# Altium schematic sheet TSE_mother_board_MCU.SchDoc
size 594 x 420 mm; SheetNumber: 2; SheetTotal: 3
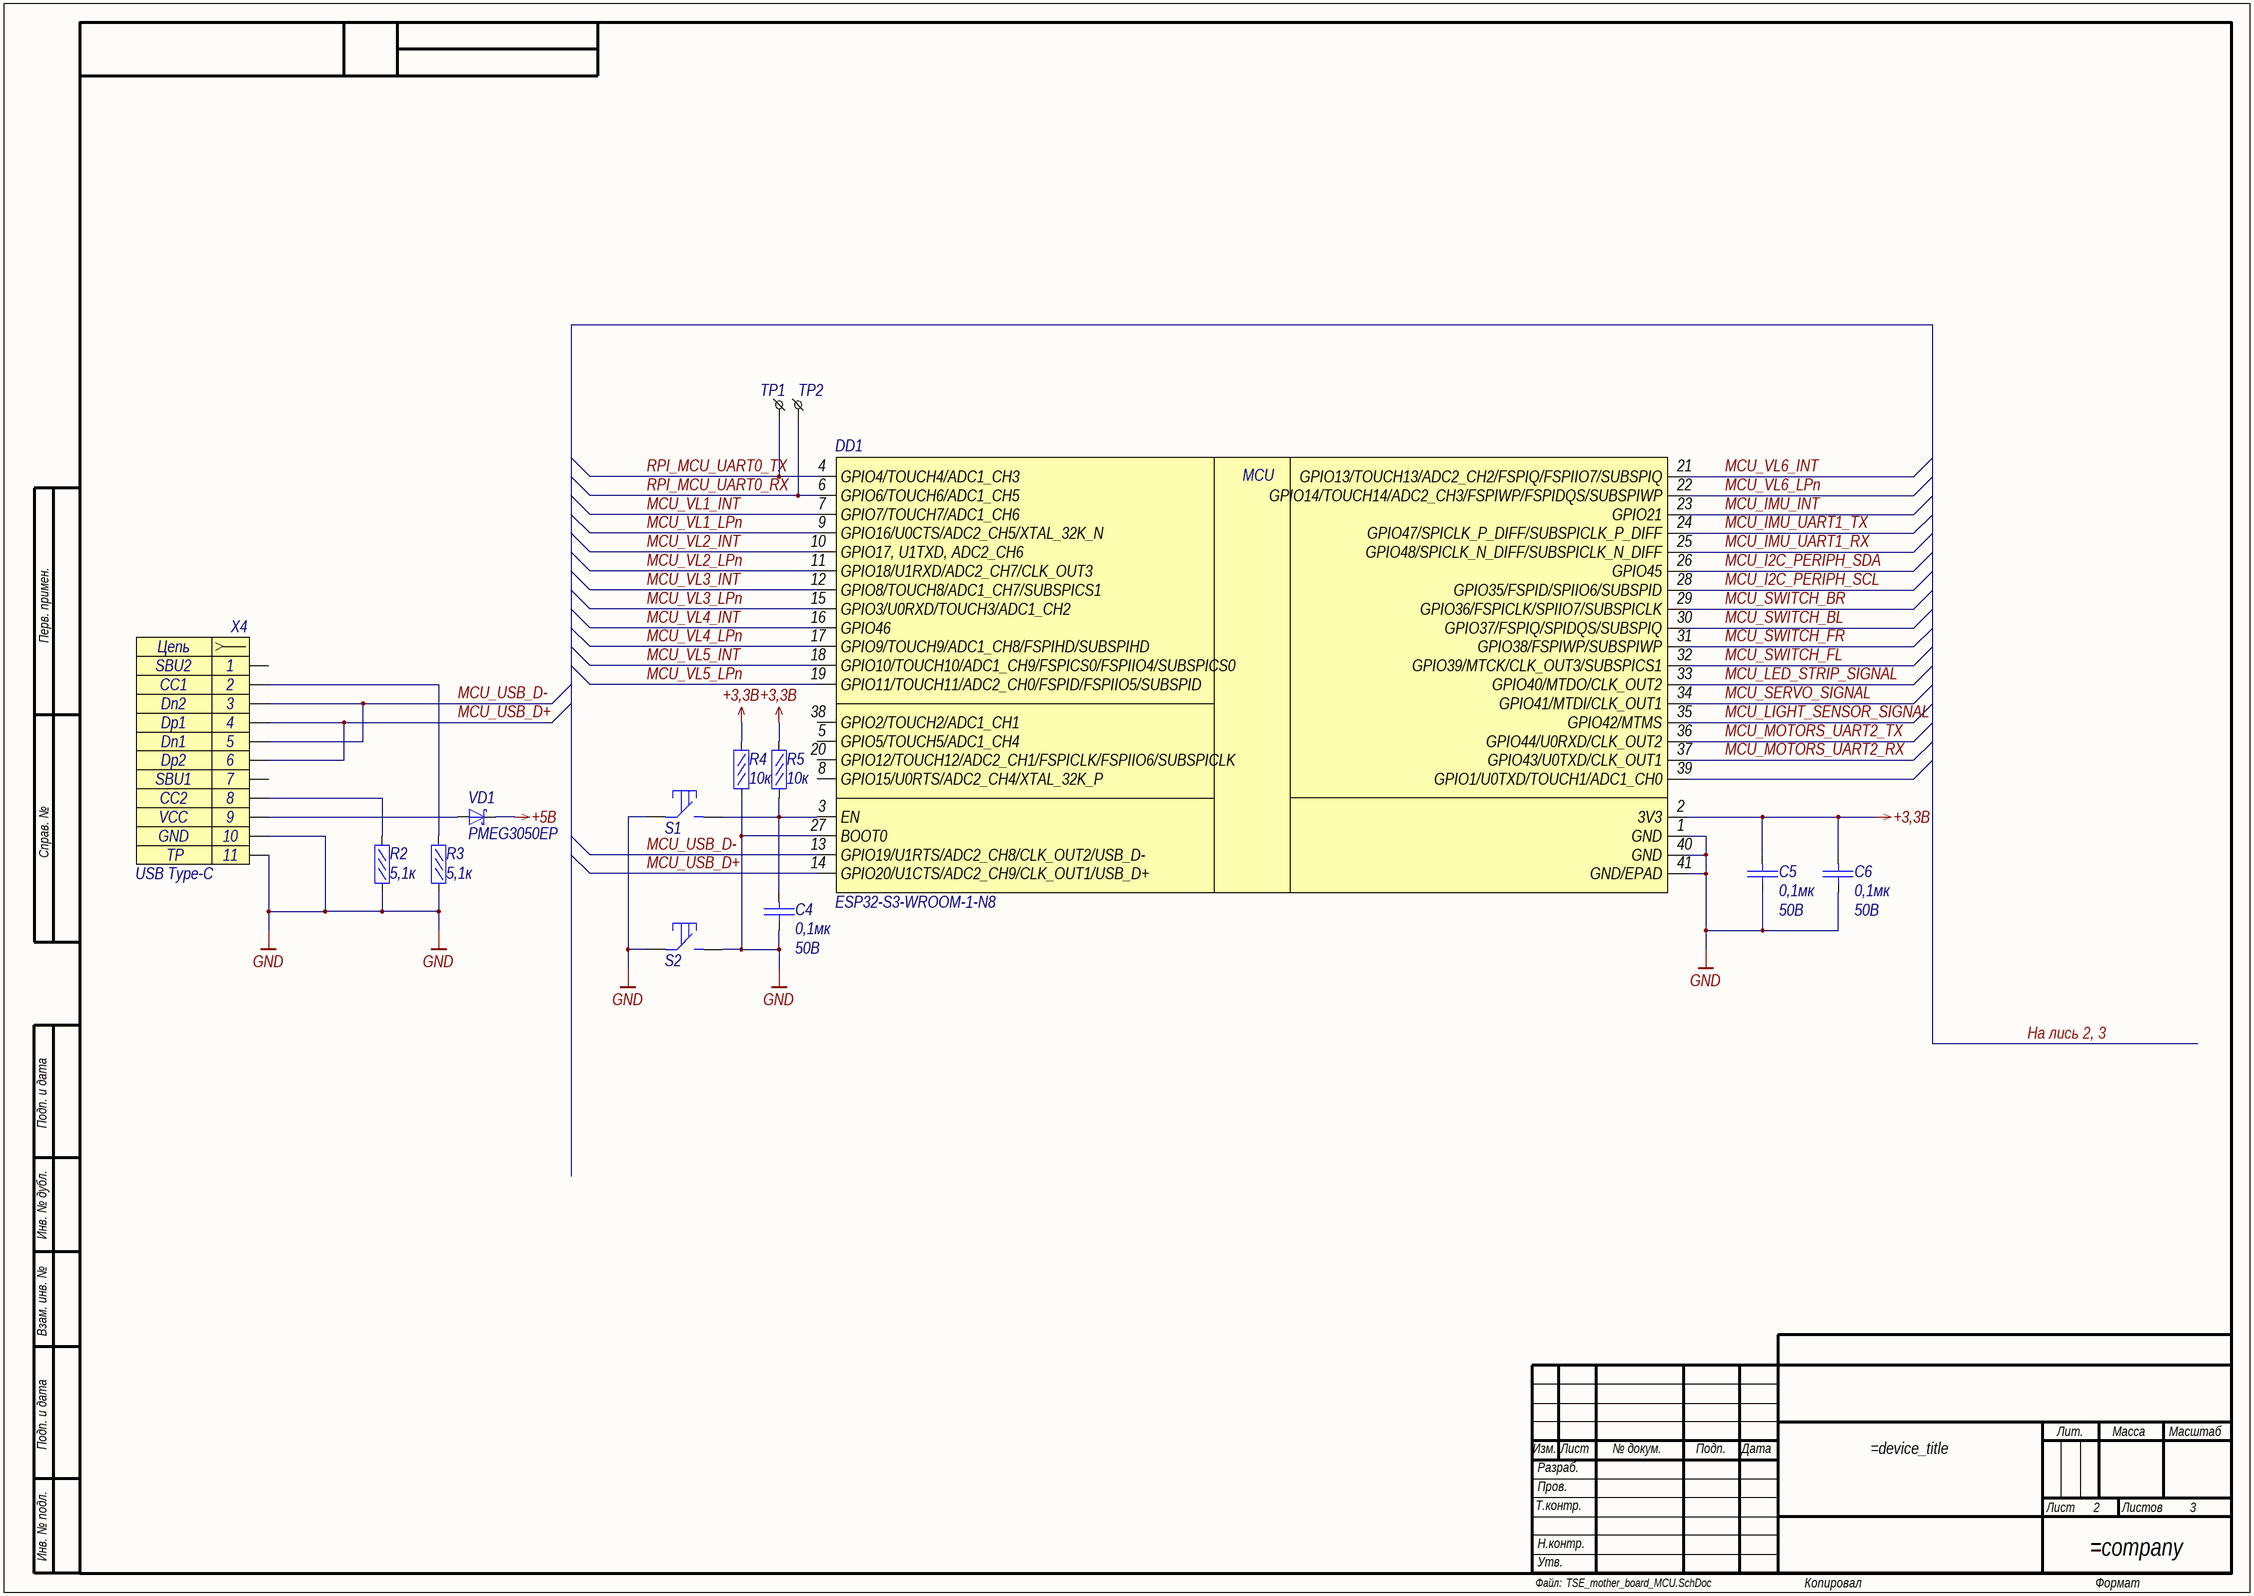
[diagram p0: TSE_mother_board_MCU.SchDoc]

## Parts
C4  Voltage: 50В  [C0603]  (hidden comment: 0,1мк)
C5  Voltage: 50В  [C0603]  (hidden comment: 0,1мк)
C6  Voltage: 50В  [C0603]  (hidden comment: 0,1мк)
DD1  ESP32-S3-WROOM-1-N8  [ESP32-S3-WROOM-1]
R2  5,1к  [R0603]
R3  5,1к  [R0603]
R4  10к  [R0603]
R5  10к  [R0603]
S1  IT-1187  [SMD button 6x3mm]  (value not drawn)
S2  IT-1187  [SMD button 6x3mm]  (value not drawn)
TP1  TESTPOINT  [TP_0,6X1]  (value not drawn)  (no BOM)
TP2  TESTPOINT  [TP_0,6X1]  (value not drawn)  (no BOM)
VD1  PMEG3050EP  [SOD128]
X4  USB Type-C  [USB4105-15-A-120]

## Nets
+3,3В: C5.2 C6.2 DD1.2(3V3) R4.2 R5.2
+5В: VD1.1(K)
GND: C4.1 C5.1 C6.1 DD1.1(GND) DD1.27(BOOT0) DD1.40(GND) DD1.41(GND/EPAD) R2.1 R3.1 R4.1 S1.1 S2.1 S2.2 X4.10(VCC) X4.TP
MCU_I2C_PERIPH_SCL: DD1.28(GPIO35/FSPID/SPIIO6/SUBSPID)
MCU_I2C_PERIPH_SDA: DD1.26(GPIO45)
MCU_IMU_INT: DD1.23(GPIO21)
MCU_IMU_UART1_RX: DD1.25(GPIO48/SPICLK_N_DIFF/SUBSPICLK_N_DIFF)
MCU_IMU_UART1_TX: DD1.24(GPIO47/SPICLK_P_DIFF/SUBSPICLK_P_DIFF)
MCU_LED_STRIP_SIGNAL: DD1.33(GPIO40/MTDO/CLK_OUT2)
MCU_LIGHT_SENSOR_SIGNAL: DD1.35(GPIO42/MTMS)
MCU_MOTORS_UART2_RX: DD1.37(GPIO43/U0TXD/CLK_OUT1)
MCU_MOTORS_UART2_TX: DD1.36(GPIO44/U0RXD/CLK_OUT2)
MCU_SERVO_SIGNAL: DD1.34(GPIO41/MTDI/CLK_OUT1)
MCU_SWITCH_BL: DD1.30(GPIO37/FSPIQ/SPIDQS/SUBSPIQ)
MCU_SWITCH_BR: DD1.29(GPIO36/FSPICLK/SPIIO7/SUBSPICLK)
MCU_SWITCH_FL: DD1.32(GPIO39/MTCK/CLK_OUT3/SUBSPICS1)
MCU_SWITCH_FR: DD1.31(GPIO38/FSPIWP/SUBSPIWP)
MCU_USB_D+: DD1.14(GPIO20/U1CTS/ADC2_CH9/CLK_OUT1/USB_D+) X4.4(A6) X4.6(B6)
MCU_USB_D-: DD1.13(GPIO19/U1RTS/ADC2_CH8/CLK_OUT2/USB_D-) X4.3(B7) X4.5(A7)
MCU_VL1_INT: DD1.7(GPIO7/TOUCH7/ADC1_CH6)
MCU_VL1_LPn: DD1.9(GPIO16/U0CTS/ADC2_CH5/XTAL_32K_N)
MCU_VL2_INT: DD1.10(GPIO17,_U1TXD,_ADC2_CH6)
MCU_VL2_LPn: DD1.11(GPIO18/U1RXD/ADC2_CH7/CLK_OUT3)
MCU_VL3_INT: DD1.12(GPIO8/TOUCH8/ADC1_CH7/SUBSPICS1)
MCU_VL3_LPn: DD1.15(GPIO3/U0RXD/TOUCH3/ADC1_CH2)
MCU_VL4_INT: DD1.16(GPIO46)
MCU_VL4_LPn: DD1.17(GPIO9/TOUCH9/ADC1_CH8/FSPIHD/SUBSPIHD)
MCU_VL5_INT: DD1.18(GPIO10/TOUCH10/ADC1_CH9/FSPICS0/FSPIIO4/SUBSPICS0)
MCU_VL5_LPn: DD1.19(GPIO11/TOUCH11/ADC2_CH0/FSPID/FSPIIO5/SUBSPID)
MCU_VL6_INT: DD1.21(GPIO13/TOUCH13/ADC2_CH2/FSPIQ/FSPIIO7/SUBSPIQ)
MCU_VL6_LPn: DD1.22(GPIO14/TOUCH14/ADC2_CH3/FSPIWP/FSPIDQS/SUBSPIWP)
RPI_MCU_UART0_RX: DD1.6(GPIO6/TOUCH6/ADC1_CH5) TP2.1
RPI_MCU_UART0_TX: DD1.4(GPIO4/TOUCH4/ADC1_CH3) TP1.1
NetC4_2: C4.2 DD1.3(EN) R5.1 S1.2
NetR2_2: R2.2 X4.8(B5)
NetR3_2: R3.2 X4.2(A5)
NetVD1_2: VD1.2(A) X4.9(GND)

Not connected (* = marked no-connect by the designer): DD1 5(GPIO5/TOUCH5/ADC1_CH4) 8(GPIO15/U0RTS/ADC2_CH4/XTAL_32K_P) 20(GPIO12/TOUCH12/ADC2_CH1/FSPICLK/FSPIIO6/SUBSPICLK) 38(GPIO2/TOUCH2/ADC1_CH1) 39(GPIO1/U0TXD/TOUCH1/ADC1_CH0); X4 1(B8) 7(A8)

## Notes on the sheet
- На лись 2, 3
- Перв. примен.
- Справ. №
- Подп. и дата
- Инв. № дубл.
- Взам. инв. №
- Изм.
- Лист
- № докум.
- Подп.
- Дата
- Лит.
- Масса
- Масштаб
- Т.контр.
- Пров.
- Разраб.
- Листов
- Инв. № подл.
- Н.контр.
- Файл:
- Утв.
- Копировал
- Формат
- (in symbol ESP32-S3-WROOM-1-N8) MCU
- (in symbol USB4105-15-A-120) Цепь; 11

## Library data of the parts
C4-C6 = CC0603JPX7R9BB104: Конденсатор кер. 0,1мкФ 50В; Manufacturer: Yageo; TKE: X7R; Name: CC0603JPX7R9BB104; Value: 0,1мк
DD1 = ESP32-S3-WROOM-1-N8: Микроконтроллер; Наименование: ESP32-S3-WROOM-1-N8
R2 R3 = RC0603FR-075K1L: Резистор 5,1кОм 0,1Вт 1%; Manufacturer: YAGEO; Name: RC0603FR-075K1L; Tolerance: 1%; Value: 5,1к
R4 R5 = RC0603FR-0710KL: Резистор 10кОм 0,063Вт 1%; Manufacturer: YAGEO; Name: RC0603FR-0710KL; Tolerance: 1%; Value: 10к
S1 S2 = button: тактовая кнопка SMD; Name: IT-1187
TP1 TP2 = TESTPOINT_HOLE: Name: TESTPOINT
VD1 = PMEG3050EP_1: Диод Шоттки 30В 5А; Manufacturer: NXP; Name: PMEG3050EP
X4 = USB4105-15-A-120: USB Type-C USB4105-GF-A / GCT; Contact_1: SBU2; Contact_2: CC1; Contact_3: Dn2; Contact_4: Dp1; Contact_5: Dn1; Contact_6: Dp2; Contact_7: SBU1; Contact_8: CC2; Contact_9: VCC; Contact_10: GND; Name: USB Type-C